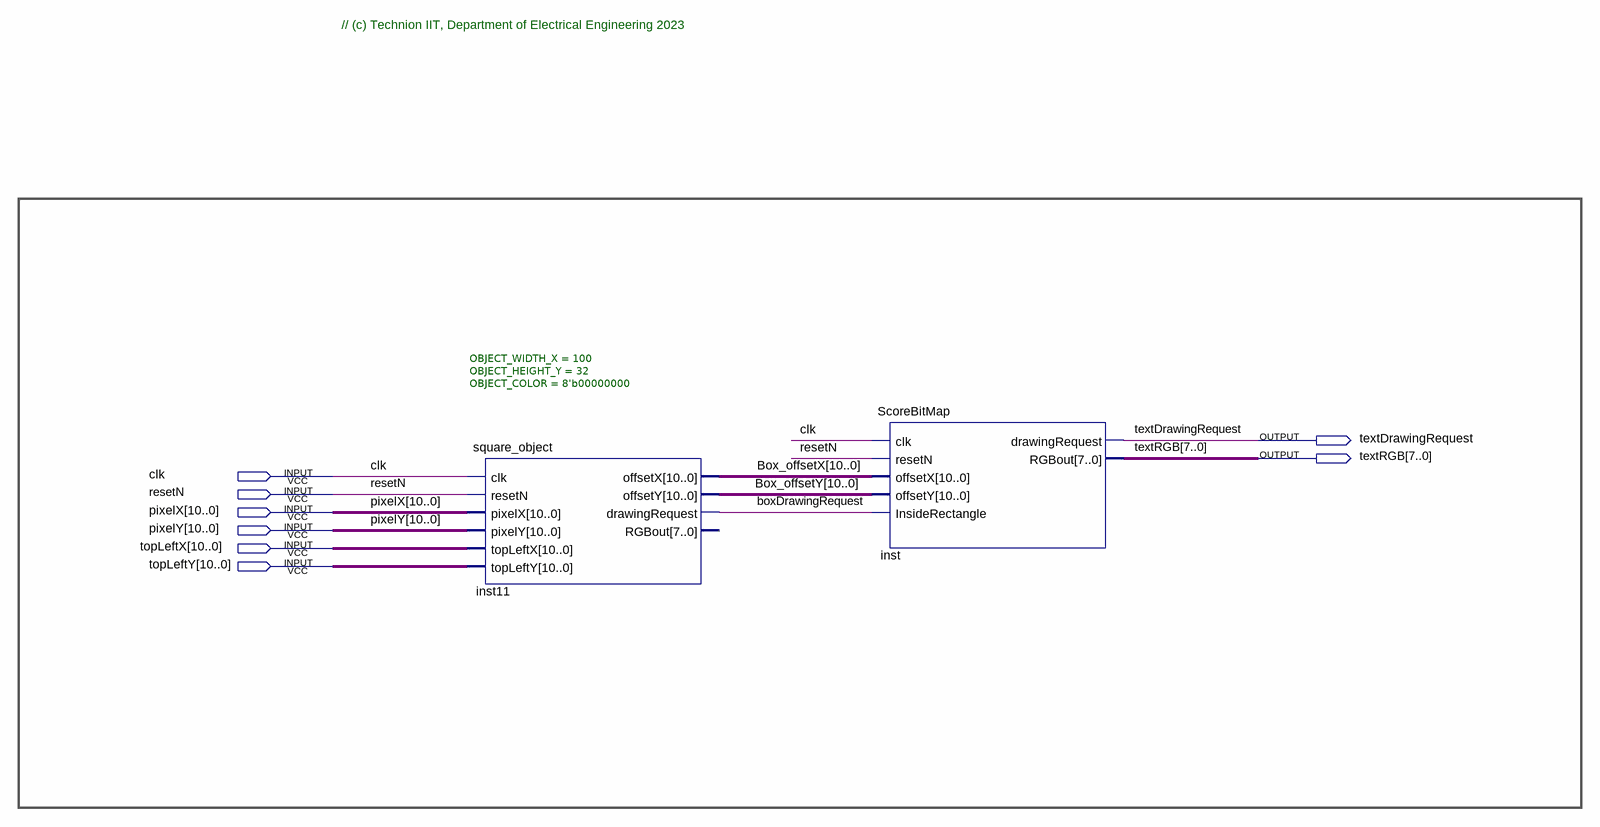
[diagram p0: schematic sheet]
// Quartus schematic Score_TEXT_DISPLAY.bdf as structural Verilog: 2 symbols, 8 pins
module Score_TEXT_DISPLAY (
  input  clk,
  input  resetN,
  input  [10:0] pixelX,
  input  [10:0] pixelY,
  input  [10:0] topLeftX,
  input  [10:0] topLeftY,
  output textDrawingRequest,
  output [7:0] textRGB
);

  wire boxDrawingRequest;
  wire [10:0] Box_offsetX, Box_offsetY;

  square_object #(.OBJECT_WIDTH_X(100), .OBJECT_HEIGHT_Y(32), .OBJECT_COLOR(8'b00000000)) inst11 (
    .clk(clk), .resetN(resetN), .pixelX(pixelX), .pixelY(pixelY), .topLeftX(topLeftX), .topLeftY(topLeftY),
    .offsetX(Box_offsetX), .offsetY(Box_offsetY), .drawingRequest(boxDrawingRequest));  // open: RGBout
  ScoreBitMap inst (
    .clk(clk), .resetN(resetN), .offsetX(Box_offsetX), .offsetY(Box_offsetY),
    .InsideRectangle(boxDrawingRequest), .drawingRequest(textDrawingRequest), .RGBout(textRGB));

  // Notes on the sheet:
  //   // (c) Technion IIT, Department of Electrical Engineering 2023
endmodule
